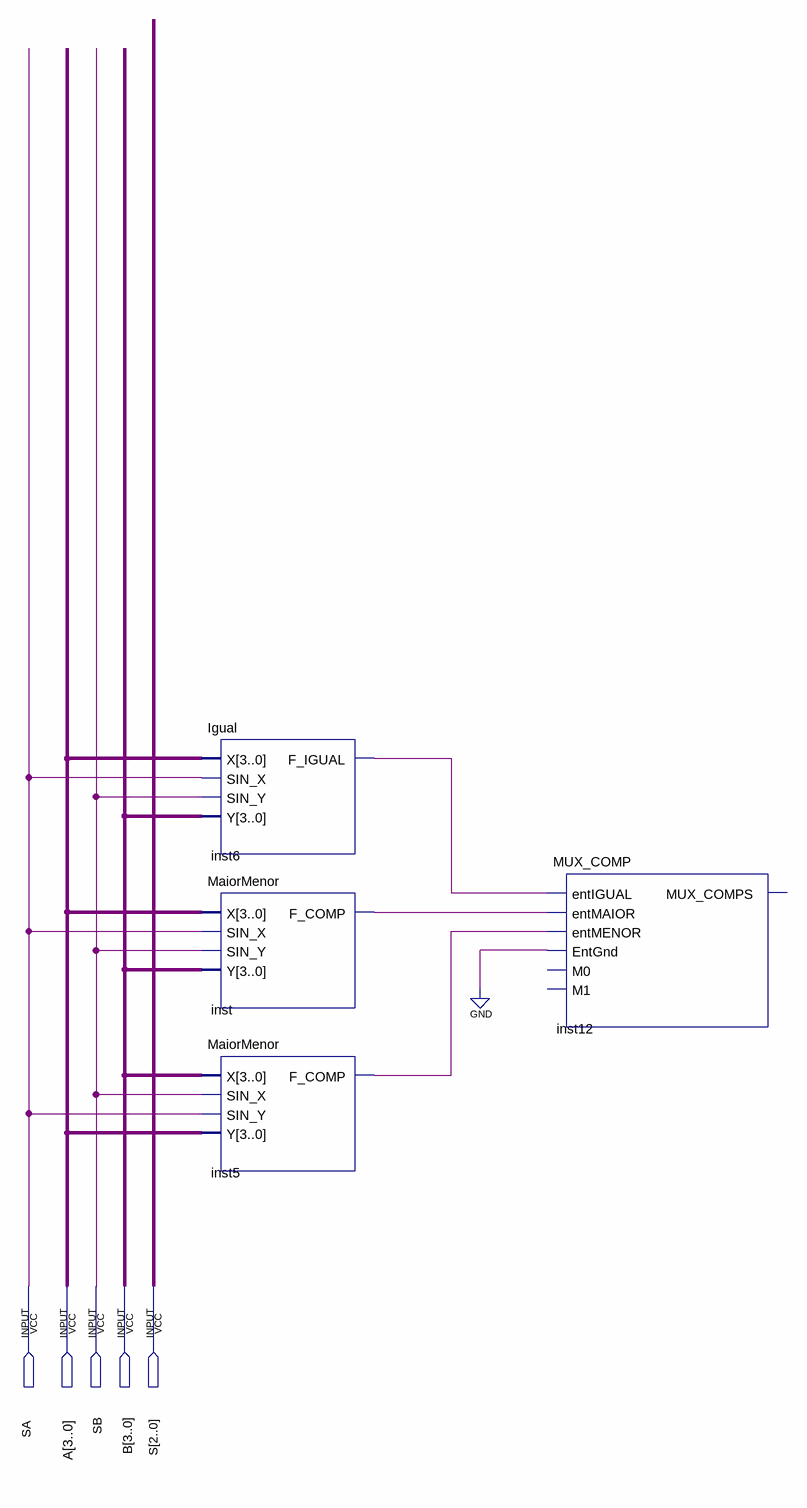
[diagram p0: schematic sheet]
// Quartus schematic trabalhoSD.bdf as structural Verilog: 4 symbols, 5 pins
module trabalhoSD (
  input  SA,
  input  [3:0] A,
  input  SB,
  input  [3:0] B,
  input  [2:0] S
);

  wire inst5_f_comp, inst6_f_igual, inst_f_comp;

  Igual inst6 (.X(A), .SIN_X(SA), .SIN_Y(SB), .Y(B), .F_IGUAL(inst6_f_igual));
  MaiorMenor inst (.X(A), .SIN_X(SA), .SIN_Y(SB), .Y(B), .F_COMP(inst_f_comp));
  MaiorMenor inst5 (.X(B), .SIN_X(SB), .SIN_Y(SA), .Y(A), .F_COMP(inst5_f_comp));
  MUX_COMP inst12 (
    .entIGUAL(inst6_f_igual), .entMAIOR(inst_f_comp), .entMENOR(inst5_f_comp), .EntGnd(1'b0));  // open: M0, M1, MUX_COMPS
endmodule
